# EAGLE design whip-o-meter_v1.0 (EAGLE 5.11)
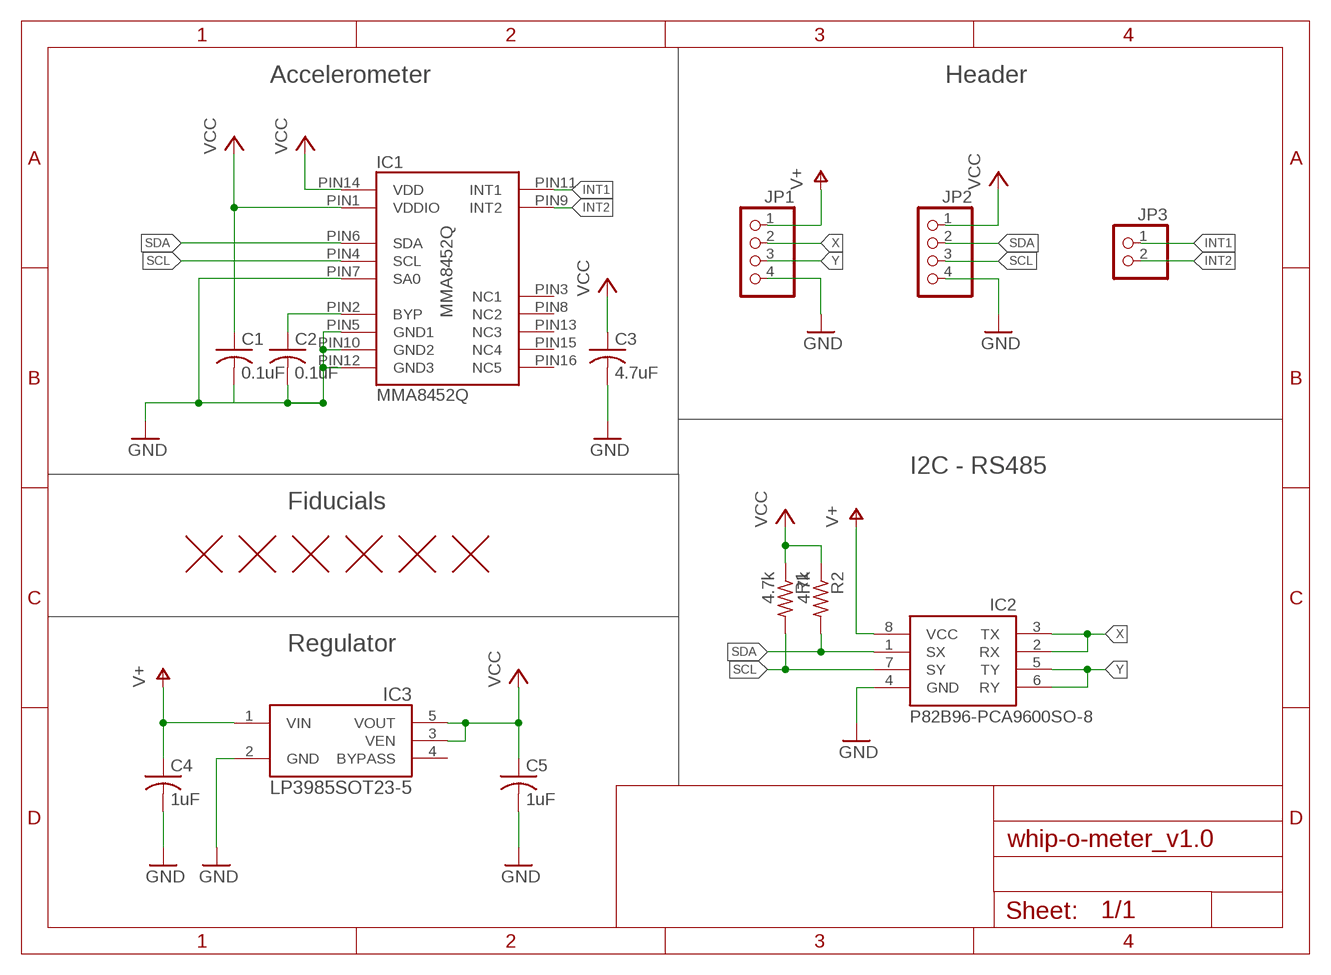
[diagram p0: schematic, sheet 1]

## Parts
C1  0.1uF  C-USC0603  [C0603]
C2  0.1uF  C-USC0603  [C0603]
C3  4.7uF  C-USC0603  [C0603]
C4  1uF  C-USC0603  [C0603]
C5  1uF  C-USC0603  [C0603]
IC1  MMA8452Q  [QFN-16]
IC2  P82B96-PCA9600SO-8  [SO-8]
IC3  LP3985SOT23-5  [SOT23-5]
JP1  PINHD-1X4  [1X04]
JP2  PINHD-1X4  [1X04]
JP3  PINHD-1X2  [1X02]
R1  4.7k  R-US_R0603  [R0603]
R2  4.7k  R-US_R0603  [R0603]
U$1  FIDUCIAL1X2  [FIDUCIAL-1X2]
U$2  FIDUCIAL1X2  [FIDUCIAL-1X2]
U$3  FIDUCIAL1X2  [FIDUCIAL-1X2]
U$4  FIDUCIAL1X2  [FIDUCIAL-1X2]
U$5  FIDUCIAL1X2  [FIDUCIAL-1X2]
U$6  FIDUCIAL1X2  [FIDUCIAL-1X2]

## Nets
GND: C1.2 C2.2 C3.2 C4.2 C5.2 IC1.PIN5(GND1) IC1.PIN7(SA0) IC1.PIN10(GND2) IC1.PIN12(GND3) IC2.4(GND) IC3.2(GND) JP1.4 JP2.4
INT1: IC1.PIN11(INT1) JP3.1
INT2: IC1.PIN9(INT2) JP3.2
N$16: C2.1 IC1.PIN2(BYP)
SCL: IC1.PIN4(SCL) IC2.7(SY) JP2.3 R1.2
SDA: IC1.PIN6(SDA) IC2.1(SX) JP2.2 R2.2
V+: C4.1 IC2.8(VCC) IC3.1(VIN) JP1.1
VCC: C1.1 C3.1 C5.1 IC1.PIN1(VDDIO) IC1.PIN14(VDD) IC3.3(VEN) IC3.5(VOUT) JP2.1 R1.1 R2.1
X: IC2.2(RX) IC2.3(TX) JP1.2
Y: IC2.5(TY) IC2.6(RY) JP1.3
Unconnected: IC1.PIN3(NC1) IC1.PIN8(NC2) IC1.PIN13(NC3) IC1.PIN15(NC4) IC1.PIN16(NC5) IC3.4(BYPASS)

## Notes on the sheet
- Accelerometer | Header
- I2C - RS485
- Fiducials
- Regulator

## Library data of the parts
C1-C5 = rcl:C-US: CAPACITOR, American symbol
IC1 = eski-ic:MMA8452Q: Three axis I2C accelerometer.
IC2 = Sparky:P82B96-PCA9600: P822B96 and PCA9600, bipolar IC creating a non-latching, bidirectional, logic interface between the normal I2C bus and a range of other bus configuration icluding rs485.
IC3 = Sparky:LP3985
JP1 JP2 = pinhead:PINHD-1X4: PIN HEADER
JP3 = pinhead:PINHD-1X2: PIN HEADER
R1 R2 = rcl:R-US_: RESISTOR, American symbol
U$1-U$6 = SparkFunEagle-6-6-07:FIDUCIAL: Fiducial Alignment Points Various fiducial points for machine vision alignment.

## Board
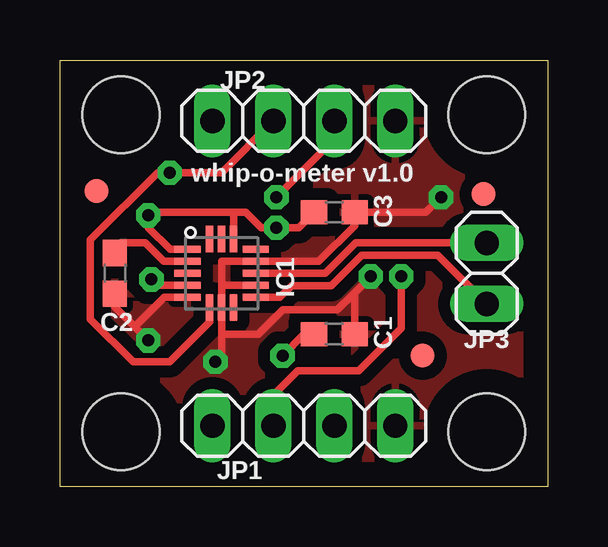
[diagram p1: board, top side]
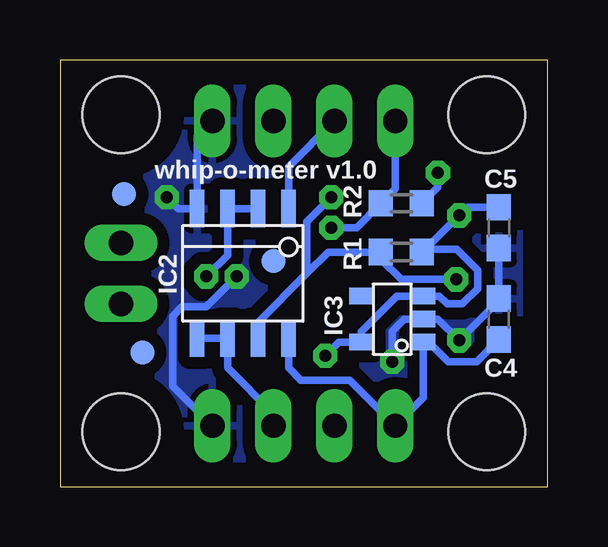
[diagram p2: board, bottom side, seen from below]

Size 20.32 x 17.78 mm. Coordinates in mm from the lower left corner, seen from the top.
Outline: 0,0 0,17.78 20.32,17.78 20.32,0 0,0
Copper layers (1+16): Top 0.0356mm / dielectric 0.5004mm / Bottom 0.0356mm
Design rules "ESKI_design_rules *": minimum track width 8mil, minimum drill 15mil, track to track 7mil, track to pad 7mil, pad to pad 7mil, via to via 7mil, smd to smd 6mil, copper to edge 40mil, drill to drill 8mil, minimum pad ring 10mil, minimum via ring 10mil, stop-mask expansion 4mil, vias tented up to drill 50mil, thermal gap 10mil
Holes 3.2 mm at 2.54,15.49 17.78,15.49 17.78,2.29 2.54,2.29

### Footprints (pad centres in the part's own frame; a part is rotated, then mirrored left to right if it is on the bottom)
C0603 = smd 1.1 x 1: 1 -0.85,0; 2 0.85,0
QFN-16 = smd 1.1 x 0.3: PIN1 -1.425,1; PIN2 -1.425,0.5; PIN3 -1.425,0; PIN4 -1.425,-0.5; PIN5 -1.425,-1; PIN9 1.425,-1; PIN10 1.425,-0.5; PIN11 1.425,0; PIN12 1.425,0.5; PIN13 1.425,1 | smd 0.3 x 1.1: PIN6 -0.5,-1.425; PIN7 0,-1.425; PIN8 0.5,-1.425; PIN14 0.5,1.425; PIN15 0,1.425; PIN16 -0.5,1.425
SO-8 = smd 0.6 x 1.55: 1 -1.905,-2.7; 2 -0.635,-2.7; 3 0.635,-2.7; 4 1.905,-2.7; 5 1.905,2.7; 6 0.635,2.7; 7 -0.635,2.7; 8 -1.905,2.7
SOT23-5 = smd 0.69 x 0.99: 1 -0.955,-1.295; 2 0,-1.295; 3 0.955,-1.295; 4 0.955,1.295; 5 -0.955,1.295
1X04 = drill 1.016 long: 1 -3.81,0; 2 -1.27,0; 3 1.27,0; 4 3.81,0
1X02 = drill 1.016 long: 1 -1.27,0; 2 1.27,0
R0603 = smd 1 x 1.1: 1 -0.85,0; 2 0.85,0
FIDUCIAL-1X2 = smd 1 x 1: 1 0,0

### Placement (x,y rotation side)
C1  11.43,6.35 0 top
C2  2.29,8.89 270 top
C3  11.43,11.43 0 top
C4  2.03,6.99 90 bottom
C5  2.03,10.79 270 bottom
IC1  6.73,8.89 0 top
IC2  12.7,8.89 180 bottom
IC3  6.48,6.99 90 bottom
JP1  10.16,2.54 0 top
JP2  10.16,15.24 0 top
JP3  17.78,8.89 270 top
R1  6.1,9.78 180 bottom
R2  6.1,11.81 0 bottom
U$1  11.43,9.4 0 bottom
U$2  1.52,12.32 0 top
U$3  17.65,12.19 0 bottom
U$4  17.65,12.19 0 top
U$5  16.89,5.59 0 bottom
U$6  15.11,5.46 0 top

### Tracks (layer width: path | path; a pad name or v marks a point on that pad's centre or on a via)
GND  (via drill 0.5)
  Top 0.305: 6.73,8.39 IC1.PIN10 | 6.73,8.39 IC1.PIN7 6.73,6.35 | 6.73,8.39 6.73,9.39 IC1.PIN12 10.79,9.39 12.28,10.88 C3.2 15.24,11.43 v15.88,12.06 | 6.73,6.35 6.73,5.46 v6.48,5.21 | 3.11,6.67 2.29,7.49 C2.2 2.44,7.89 | 3.11,6.67 v3.68,6.1 | IC1.PIN5 4.33,7.89 3.11,6.67 | 6.73,6.35 8.26,6.35 9.27,7.37 11.56,7.37 12.26,8.06 | 12.51,6.58 C1.2 12.28,8.04 12.26,8.06 | 12.26,8.06 v12.95,8.76
  Bottom 0.305: C5.2 C4.2 2.03,7.75 v3.68,6.1 4.57,6.99 IC3.2 5.97,6.99 6.48,6.48 v6.48,5.21 | JP2.4 14.61,14.61 IC2.4 15.4,11.59 v15.88,12.06 | JP1.4 15.62,4.19 15.62,7.11 15.24,7.49 14.22,7.49 v12.95,8.76
  pour Bottom (isolate 0.508): 0,17.78 0,0 20.32,0 20.32,17.78
  pour Top (isolate 0.508): 0,17.78 0,0 20.32,0 20.32,17.78
INT1
  Top 0.305: IC1.PIN11 11.05,8.89 12.32,10.16 JP3.1
INT2
  Top 0.305: IC1.PIN9 9.16,7.89 9.65,8.38 11.3,8.38 12.57,9.65 15.75,9.65 JP3.2
N$16
  Top 0.305: 2.64,9.39 C2.1 2.29,9.91 2.54,10.16 3.56,10.16 4.33,9.39 IC1.PIN2
SCL  (via drill 0.5)
  Top 0.305: IC1.PIN4 4.06,8.39 v3.81,8.64 | JP2.3 11.43,14.48 v9.02,12.06
  Bottom 0.305: v3.81,8.64 6.1,8.64 6.95,9.49 R1.2 9.14,9.78 10.03,8.89 | IC2.7 12.06,6.86 10.03,8.89 | 10.03,8.89 10.03,11.05 v9.02,12.06
SDA  (via drill 0.5)
  Top 0.305: IC1.PIN6 6.23,6.87 4.57,5.21 3.05,5.21 1.27,6.99 1.27,10.29 4.06,13.08 v4.57,13.08 6.73,13.08 JP2.2
  Bottom 0.305: R2.2 4.57,12.48 v4.57,13.08 | IC2.1 10.79,13.34 JP2.2
V+
  Bottom 0.305: IC2.8 10.79,4.95 10.29,4.45 8.26,4.45 JP1.1 5.18,3.71 IC3.1 5.08,6.13 4.15,5.21 2.96,5.21 C4.1
VCC  (via drill 0.5)
  Top 0.305: IC1.PIN1 4.59,9.89 3.68,10.79 v3.68,11.3 3.81,11.43 7.23,11.43 | C1.1 10.16,6.35 v9.27,5.46 | 7.23,11.43 IC1.PIN14 | C3.1 9.95,10.79 v9.02,10.79 8.38,10.79 7.75,11.43 7.23,11.43
  Bottom 0.305: C5.1 3.34,11.64 v3.68,11.3 5.1,9.89 IC1.PIN1 | R2.1 6.35,12.41 JP2.1 | R2.1 6.95,11.43 | v9.27,5.46 8.7,6.03 IC3.5 7.77,6.45 6.28,7.94 IC3.3 4.51,7.94 4.19,7.62 3.56,7.62 2.92,8.26 2.92,9.02 3.79,9.89 IC1.PIN1 | R1.1 5.25,9.83 IC1.PIN1 | R2.1 7.96,10.79 v9.02,10.79
X  (via drill 0.5)
  Top 0.305: JP1.2 8.89,3.81 9.91,4.83 12.45,4.83 14.22,6.6 v14.22,8.76
  Bottom 0.305: IC2.2 IC2.3 13.34,9.65 v14.22,8.76
Y
  Bottom 0.305: IC2.5 IC2.6 13.34,4.95 11.43,3.05 JP1.3

### Text on the board
tPlace: whip-o-meter v1.0
bPlace: whip-o-meter v1.0